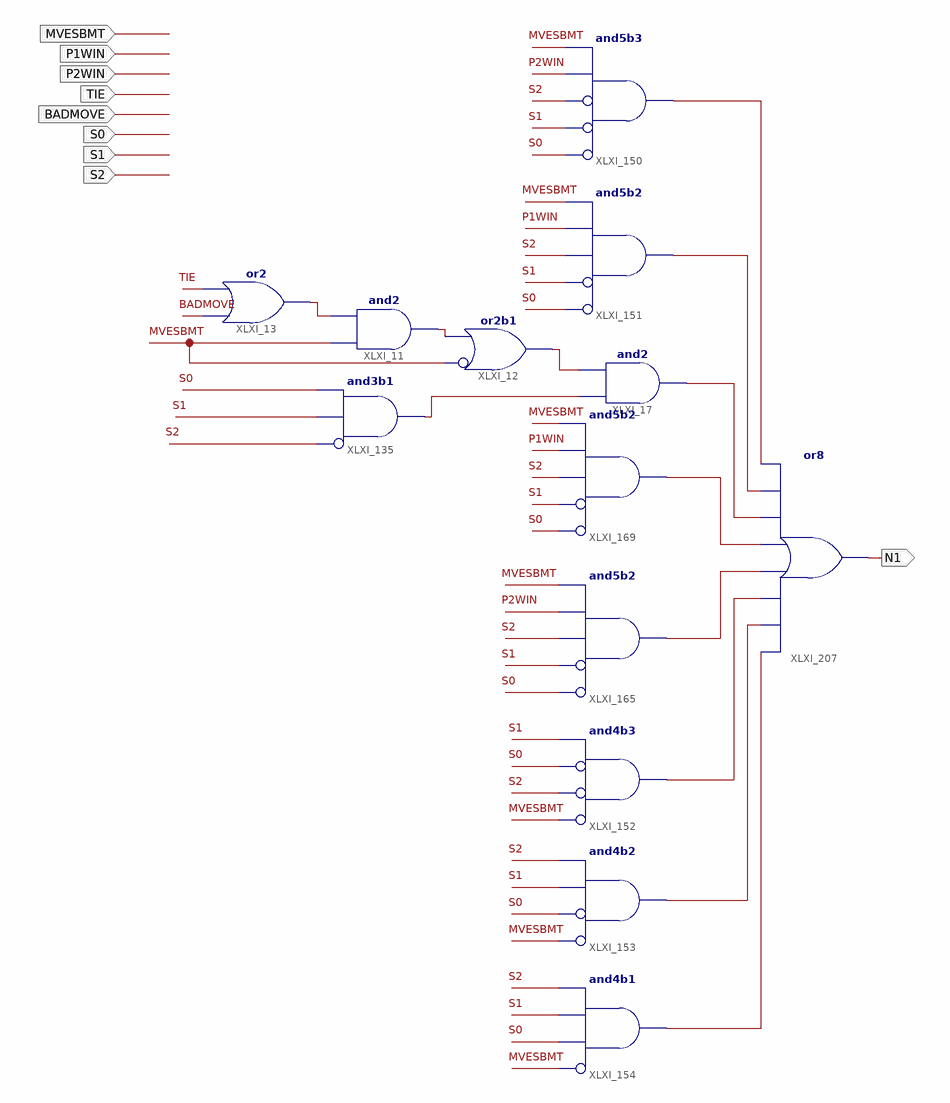
[diagram p0: schematic sheet 1]
// Xilinx ISE schematic N1Logic.sch (spartan6) as structural Verilog: 13 symbols, 9 ports
module N1Logic (
  input  TIE,
  input  BADMOVE,
  input  MVESBMT,
  input  S0,
  input  S1,
  input  S2,
  input  P1WIN,
  input  P2WIN,
  output N1
);

  wire XLXN_70, XLXN_87, XLXN_89, XLXN_117, XLXN_685, XLXN_686, XLXN_691, XLXN_692, XLXN_693, XLXN_694,
       XLXN_695, XLXN_696;

  or XLXI_207 (N1, XLXN_696, XLXN_695, XLXN_694, XLXN_693, XLXN_692, XLXN_691, XLXN_686, XLXN_685);
  or XLXI_13 (XLXN_70, BADMOVE, TIE);
  and XLXI_11 (XLXN_87, MVESBMT, XLXN_70);
  and XLXI_135 (XLXN_117, ~S2, S1, S0);  // and3b1
  or XLXI_12 (XLXN_89, ~MVESBMT, XLXN_87);  // or2b1
  and XLXI_17 (XLXN_691, XLXN_117, XLXN_89);
  and XLXI_169 (XLXN_692, ~S0, ~S1, S2, P1WIN, MVESBMT);  // and5b2
  and XLXI_151 (XLXN_686, ~S0, ~S1, S2, P1WIN, MVESBMT);  // and5b2
  and XLXI_153 (XLXN_695, ~MVESBMT, ~S0, S1, S2);  // and4b2
  and XLXI_152 (XLXN_694, ~MVESBMT, ~S2, ~S0, S1);  // and4b3
  and XLXI_165 (XLXN_693, ~S0, ~S1, S2, P2WIN, MVESBMT);  // and5b2
  and XLXI_154 (XLXN_696, ~MVESBMT, S0, S1, S2);  // and4b1
  and XLXI_150 (XLXN_685, ~S0, ~S1, ~S2, P2WIN, MVESBMT);  // and5b3
endmodule
